# Altium schematic sheet Supply.SchDoc: Supply
size A4; SheetNumber: 2; SheetTotal: 8
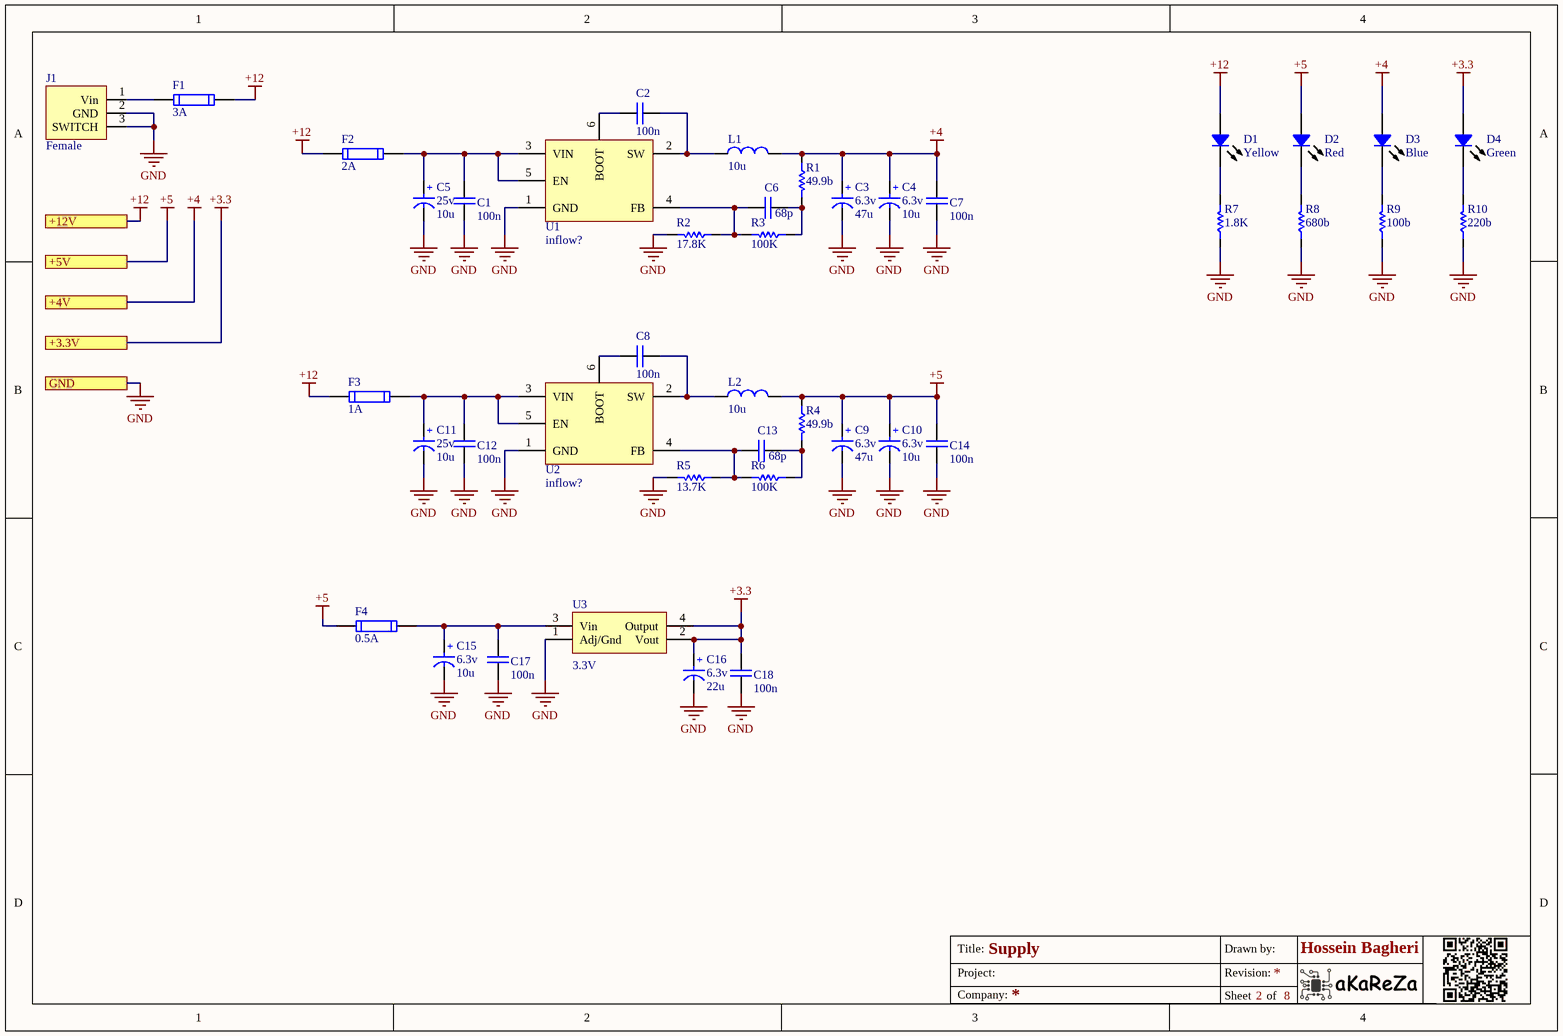
[diagram p0: Supply.SchDoc]

## Parts
C1  100n  [CAP 1206/3216]
C2  100n  [CAP 0805/2012]
C3  Rating: 6.3v  [SMT_C_Tantalum_B]  (hidden comment: 47u)
C4  Rating: 6.3v  [SMT_C_Tantalum_A]  (hidden comment: 10u)
C5  Rating: 25v  [SMT_C_Tantalum_B]  (hidden comment: 10u)
C6  68p  [CAP 0805/2012]
C7  100n  [CAP 1206/3216]
C8  100n  [CAP 0805/2012]
C9  Rating: 6.3v  [SMT_C_Tantalum_B]  (hidden comment: 47u)
C10  Rating: 6.3v  [SMT_C_Tantalum_A]  (hidden comment: 10u)
C11  Rating: 25v  [SMT_C_Tantalum_B]  (hidden comment: 10u)
C12  100n  [CAP 1206/3216]
C13  68p  [CAP 0805/2012]
C14  100n  [CAP 1206/3216]
C15  Rating: 6.3v  [SMT_C_Tantalum_A]  (hidden comment: 10u)
C16  Rating: 6.3v  [SMT_C_Tantalum_A]  (hidden comment: 22u)
C17  100n  [CAP 1206/3216]
C18  100n  [CAP 1206/3216]
D1  Yellow  [LED 0805/2012 YELLOW]
D2  Red  [LED 0805/2012 RED]
D3  Blue  [LED 0805/2012 BLUE]
D4  Green  [LED 0805/2012 GREEN]
F1  3A  [1206_F]
F2  2A  [1206_F]
F3  1A  [1206_F]
F4  0.5A  [1206_F]
J1  Female  [Power Jack BIG]
L1  10u  [L_7]
L2  10u  [L_7]
R1  49.9b  [RES 0805 (2012X06L)]
R2  17.8K  [RES 0805 (2012X06L)]
R3  100K  [RES 0805 (2012X06L)]
R4  49.9b  [RES 0805 (2012X06L)]
R5  13.7K  [RES 0805 (2012X06L)]
R6  100K  [RES 0805 (2012X06L)]
R7  1.8K  [RES 0805 (2012X06L)]
R8  680b  [RES 0805 (2012X06L)]
R9  100b  [RES 0805 (2012X06L)]
R10  220b  [RES 0805 (2012X06L)]
U1  Inflow: inflow?  [TPS54302]  (hidden comment: Value?)
U2  Inflow: inflow?  [TPS54302]  (hidden comment: Value?)
U3  3.3V  [SOT223_M]

## Ports
+3.3V, +4V, +5V, +12V, GND

## Nets
+3.3: C16.1(+) C18.1 D4.1 U3.2(Vout) U3.4(Output) ; port +3.3V
+4: C3.1(+) C4.1(+) C7.1 D3.1 L1.2 R1.1 ; port +4V
+5: C9.1(+) C10.1(+) C14.1 D2.1 F4.1 L2.2 R4.1 ; port +5V
+12: D1.1 F1.2 F2.1 F3.1 ; port +12V
GND: C1.2 C3.2(-) C4.2(-) C5.2(-) C7.2 C9.2(-) C10.2(-) C11.2(-) C12.2 C14.2 C15.2(-) C16.2(-) C17.2 C18.2 J1.2(GND) J1.3(SWITCH) R2.2 R5.2 R7.1 R8.1 R9.1 R10.1 U1.1(GND) U2.1(GND) U3.1(Adj/Gnd) ; port GND
NetC1_1: C1.1 C5.1(+) F2.2 U1.3(VIN) U1.5(EN)
NetC2_1: C2.1 U1.6(BOOT)
NetC2_2: C2.2 L1.1 U1.2(SW)
NetC6_1: C6.1 R2.1 R3.2 U1.4(FB)
NetC6_2: C6.2 R1.2 R3.1
NetC8_1: C8.1 U2.6(BOOT)
NetC8_2: C8.2 L2.1 U2.2(SW)
NetC11_1: C11.1(+) C12.1 F3.2 U2.3(VIN) U2.5(EN)
NetC13_1: C13.1 R5.1 R6.2 U2.4(FB)
NetC13_2: C13.2 R4.2 R6.1
NetC15_1: C15.1(+) C17.1 F4.2 U3.3(Vin)
NetD1_2: D1.2 R7.2
NetD2_2: D2.2 R8.2
NetD3_2: D3.2 R9.2
NetD4_2: D4.2 R10.2
NetF1_1: F1.1 J1.1(Vin)

## Notes on the sheet
- Title:
- Project:
- Drawn by:
- Revision:
- Hossein Bagheri
- Company:
- Sheet
- of

## Library data of the parts
C1 C7 C12 C14 C17 C18 = Cap_Multi_SMD_100nF_1206: Bipolar ceramic capacitor SMD; Type: MultiLayer; Inflow: inflow?; Rating: 50V; Validation: Valid; Package: 1206; Value: 100n
C2 C8 = Cap_Multi_SMD_100nF_0805: Bipolar ceramic capacitor SMD; Inflow: inflow?; Type: MultiLayer; Rating: 50V; Validation: Valid; Package: 0805; Value: 100n
C3-C5 C9-C11 C15 C16 = Cap_Tantalum: Tantalum Capacitor,TAJ Series-SMD; Inflow: inflow?; Validation: Valid; Package: Package?; Type: Tantalum
  C3 C9: Value: 47u
  C4 C5 C10 C11 C15: Value: 10u
  C16: Value: 22u
C6 C13 = Cap_Multi_SMD_0805: Bipolar ceramic capacitor SMD; Inflow: inflow?; Type: MultiLayer; Rating: Rating?; Validation: Valid; Package: 0805; Value: 68p
D1-D4 = Semi_LED_SMD: LED; Inflow: inflow?; Rating: Rating?; Validation: Valid; Package: Package?; Type: LED
  D1: Value: Yellow
  D2: Value: Red
  D3: Value: Blue
  D4: Value: Green
F1-F4 = Other_Elec_Fuse_SMD: Short circiut  protection; Inflow: inflow?; Type: Fast; Rating: Rating?; Validation: Valid; Package: 1206
  F1: Value: 3A
  F2: Value: 2A
  F3: Value: 1A
  F4: Value: 0.5A
J1 = Con_Power_Jack: Power Jack; Rating: Rating?; Validation: Valid; Inflow: 6127; Type: Type?; Package: Package?; Value: Female
L1 L2 = Ind_SMD: Inductor; Inflow: inflow?; Type: Type?; Rating: 3.8A; Validation: Valid; Package: Package?; Value: 10u
R1-R10 = Res_SMD_0805: Resistor; Inflow: inflow?; Rating: 0.125W; Validation: Valid; Package: 0805
  R1 R4: Type: 1%; Value: 49.9b
  R2: Type: 1%; Value: 17.8K
  R3 R6: Type: 1%; Value: 100K
  R5: Type: 1%; Value: 13.7K
  R7: Type: 10%; Value: 1.8K
  R8: Type: 10%; Value: 680b
  R9: Type: 10%; Value: 100b
  R10: Type: 10%; Value: 220b
U1 U2 = IC_Reg_TPS54302: 3'A Synchronous Step-Down Converter; Rating: S; Validation: Valid; Value: Value?; Type: Switching; Package: SOT-23-6
U3 = IC_Reg_AMS1117_3.3: 1'A Positive voltage regulator; Rating: 1A; Validation: Valid; Inflow: 5217; Type: LDO; Package: SOT223; Value: 3.3V